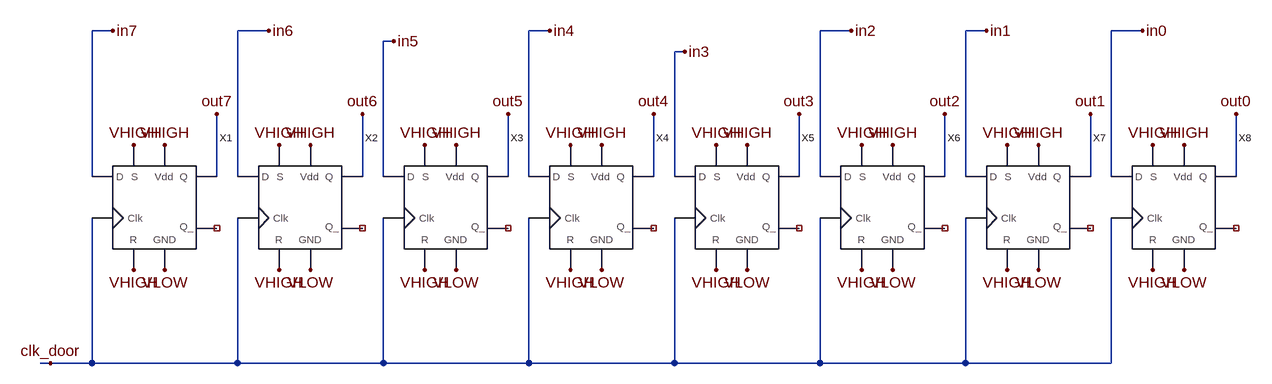
[diagram p0: schematic SAR_OutputDoor.asc]
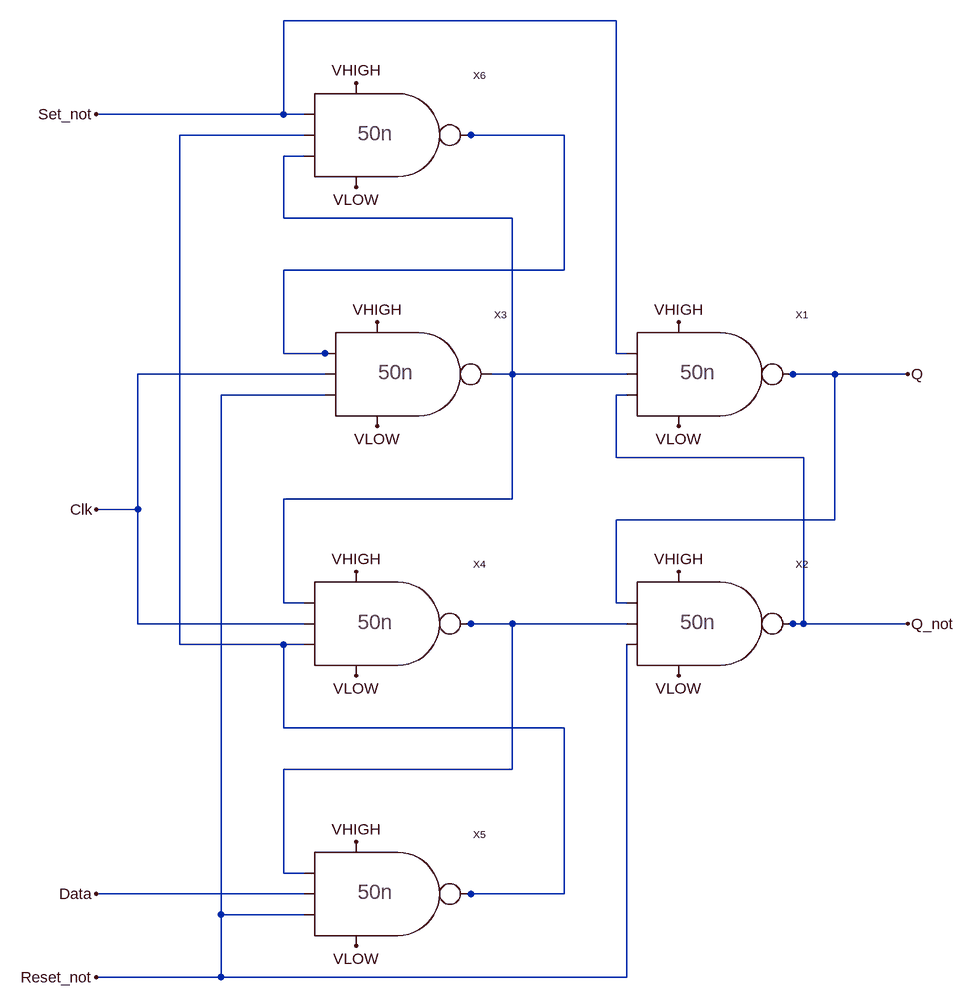
[diagram p1: sub-circuit ti_dff.asc]
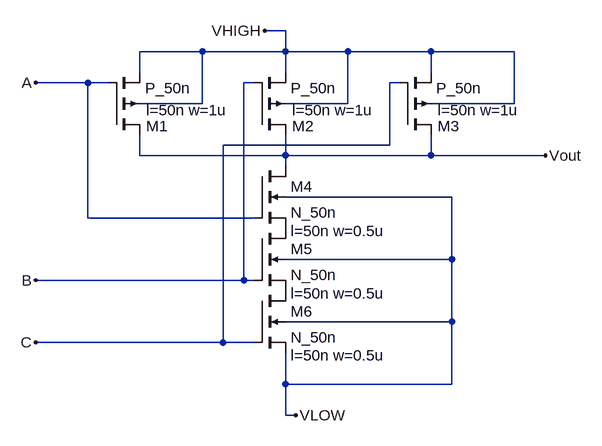
[diagram p2: sub-circuit nand3.asc]
SAR_OutputDoor.asc, the LTspice schematic file:
Version 4
SHEET 1 2904 900
WIRE -32 -96 -64 -96
WIRE 208 -96 160 -96
WIRE 640 -96 608 -96
WIRE 1104 -96 1056 -96
WIRE 1312 -96 1280 -96
WIRE 1552 -96 1504 -96
WIRE 400 -80 384 -80
WIRE 848 -64 832 -64
WIRE -64 128 -64 -96
WIRE 128 128 128 32
WIRE 160 128 160 -96
WIRE 352 128 352 32
WIRE 384 128 384 -80
WIRE 576 128 576 32
WIRE 608 128 608 -96
WIRE 800 128 800 32
WIRE 832 128 832 -64
WIRE 1024 128 1024 32
WIRE 1056 128 1056 -96
WIRE 1248 128 1248 32
WIRE 1280 128 1280 -96
WIRE 1472 128 1472 32
WIRE 1504 128 1504 -96
WIRE 1696 128 1696 32
WIRE -128 416 -144 416
WIRE -64 416 -64 192
WIRE -64 416 -128 416
WIRE 160 416 160 192
WIRE 160 416 -64 416
WIRE 384 416 384 192
WIRE 384 416 160 416
WIRE 608 416 608 192
WIRE 608 416 384 416
WIRE 832 416 832 192
WIRE 832 416 608 416
WIRE 1056 416 1056 192
WIRE 1056 416 832 416
WIRE 1280 416 1280 192
WIRE 1280 416 1056 416
WIRE 1504 416 1504 192
WIRE 1504 416 1280 416
FLAG 48 80 VHIGH
FLAG 0 80 VHIGH
FLAG 0 272 VHIGH
FLAG 48 272 VLOW
FLAG 272 80 VHIGH
FLAG 224 80 VHIGH
FLAG 224 272 VHIGH
FLAG 272 272 VLOW
FLAG 496 80 VHIGH
FLAG 448 80 VHIGH
FLAG 448 272 VHIGH
FLAG 496 272 VLOW
FLAG 720 80 VHIGH
FLAG 672 80 VHIGH
FLAG 672 272 VHIGH
FLAG 720 272 VLOW
FLAG 944 80 VHIGH
FLAG 896 80 VHIGH
FLAG 896 272 VHIGH
FLAG 944 272 VLOW
FLAG 1168 80 VHIGH
FLAG 1120 80 VHIGH
FLAG 1120 272 VHIGH
FLAG 1168 272 VLOW
FLAG 1392 80 VHIGH
FLAG 1344 80 VHIGH
FLAG 1344 272 VHIGH
FLAG 1392 272 VLOW
FLAG 1616 80 VHIGH
FLAG 1568 80 VHIGH
FLAG 1568 272 VHIGH
FLAG 1616 272 VLOW
FLAG -32 -96 in7
FLAG 208 -96 in6
FLAG 400 -80 in5
FLAG 640 -96 in4
FLAG 848 -64 in3
FLAG 1104 -96 in2
FLAG 1312 -96 in1
FLAG 1552 -96 in0
FLAG -128 416 clk_door
FLAG 128 32 out7
FLAG 352 32 out6
FLAG 576 32 out5
FLAG 800 32 out4
FLAG 1024 32 out3
FLAG 1248 32 out2
FLAG 1472 32 out1
FLAG 1696 32 out0
SYMBOL TI_DFF 32 176 R0
SYMATTR InstName X1
SYMBOL TI_DFF 256 176 R0
SYMATTR InstName X2
SYMBOL TI_DFF 480 176 R0
SYMATTR InstName X3
SYMBOL TI_DFF 704 176 R0
SYMATTR InstName X4
SYMBOL TI_DFF 928 176 R0
SYMATTR InstName X5
SYMBOL TI_DFF 1152 176 R0
SYMATTR InstName X6
SYMBOL TI_DFF 1376 176 R0
SYMATTR InstName X7
SYMBOL TI_DFF 1600 176 R0
SYMATTR InstName X8

ti_dff.asc, the sub-circuit schematic file:
Version 4
SHEET 1 1216 1124
WIRE 160 -416 -352 -416
WIRE -352 -272 -352 -416
WIRE -352 -272 -640 -272
WIRE -320 -272 -352 -272
WIRE -320 -240 -512 -240
WIRE -64 -240 -80 -240
WIRE 80 -240 -64 -240
WIRE -320 -208 -352 -208
WIRE -352 -112 -352 -208
WIRE 0 -112 -352 -112
WIRE 80 -32 80 -240
WIRE 80 -32 -352 -32
WIRE -352 96 -352 -32
WIRE -288 96 -352 96
WIRE -272 96 -288 96
WIRE 160 96 160 -416
WIRE 176 96 160 96
WIRE -288 128 -576 128
WIRE 0 128 0 -112
WIRE 0 128 -32 128
WIRE 176 128 0 128
WIRE 432 128 416 128
WIRE 496 128 432 128
WIRE 608 128 496 128
WIRE -288 160 -448 160
WIRE 176 160 160 160
WIRE 160 256 160 160
WIRE 448 256 160 256
WIRE 0 320 0 128
WIRE 0 320 -352 320
WIRE -576 336 -576 128
WIRE -576 336 -640 336
WIRE 496 352 496 128
WIRE 496 352 160 352
WIRE -352 480 -352 320
WIRE -320 480 -352 480
WIRE 160 480 160 352
WIRE 176 480 160 480
WIRE -576 512 -576 336
WIRE -320 512 -576 512
WIRE -64 512 -80 512
WIRE 0 512 -64 512
WIRE 176 512 0 512
WIRE 432 512 416 512
WIRE 448 512 448 256
WIRE 448 512 432 512
WIRE 608 512 448 512
WIRE -512 544 -512 -240
WIRE -352 544 -512 544
WIRE -320 544 -352 544
WIRE -352 672 -352 544
WIRE 80 672 -352 672
WIRE 0 736 0 512
WIRE 0 736 -352 736
WIRE -352 896 -352 736
WIRE -320 896 -352 896
WIRE -320 928 -640 928
WIRE -64 928 -80 928
WIRE 80 928 80 672
WIRE 80 928 -64 928
WIRE -448 960 -448 160
WIRE -320 960 -448 960
WIRE -448 1056 -448 960
WIRE -448 1056 -640 1056
WIRE 176 1056 176 544
WIRE 176 1056 -448 1056
FLAG -640 -272 Set_not
FLAG -640 928 Data
FLAG -640 336 Clk
FLAG -640 1056 Reset_not
FLAG 608 128 Q
FLAG 608 512 Q_not
FLAG -240 848 VHIGH
FLAG -240 432 VHIGH
FLAG 256 432 VHIGH
FLAG -240 -320 VHIGH
FLAG -208 48 VHIGH
FLAG 256 48 VHIGH
FLAG -240 -160 VLOW
FLAG -208 208 VLOW
FLAG 256 208 VLOW
FLAG -240 1008 VLOW
FLAG 256 592 VLOW
FLAG -240 592 VLOW
SYMBOL NAND3 240 128 R0
SYMATTR InstName X1
SYMBOL NAND3 240 512 R0
SYMATTR InstName X2
SYMBOL NAND3 -224 128 R0
SYMATTR InstName X3
SYMBOL NAND3 -256 512 R0
SYMATTR InstName X4
SYMBOL NAND3 -256 928 R0
SYMATTR InstName X5
SYMBOL NAND3 -256 -240 R0
SYMATTR InstName X6

nand3.asc, the sub-circuit schematic file:
Version 4
SHEET 1 880 788
WIRE 320 -96 288 -96
WIRE 192 -64 96 -64
WIRE 320 -64 320 -96
WIRE 320 -64 192 -64
WIRE 416 -64 320 -64
WIRE 544 -64 416 -64
WIRE 672 -64 544 -64
WIRE 96 -32 96 -64
WIRE 320 -32 320 -64
WIRE 544 -32 544 -64
WIRE 16 -16 -64 -16
WIRE 48 -16 16 -16
WIRE 272 -16 256 -16
WIRE 496 -16 480 -16
WIRE 192 16 192 -64
WIRE 192 16 96 16
WIRE 416 16 416 -64
WIRE 416 16 320 16
WIRE 672 16 672 -64
WIRE 672 16 544 16
WIRE 480 80 480 -16
WIRE 480 80 224 80
WIRE 96 96 96 64
WIRE 320 96 320 64
WIRE 320 96 96 96
WIRE 544 96 544 64
WIRE 544 96 320 96
WIRE 720 96 544 96
WIRE 320 112 320 96
WIRE 576 160 320 160
WIRE 16 192 16 -16
WIRE 272 192 16 192
WIRE 576 256 576 160
WIRE 576 256 320 256
WIRE 256 288 256 -16
WIRE 256 288 -64 288
WIRE 272 288 256 288
WIRE 576 352 576 256
WIRE 576 352 320 352
WIRE 224 384 224 80
WIRE 224 384 -64 384
WIRE 272 384 224 384
WIRE 320 448 320 400
WIRE 576 448 576 352
WIRE 576 448 320 448
WIRE 320 496 320 448
WIRE 336 496 320 496
FLAG -64 -16 A
FLAG -64 288 B
FLAG -64 384 C
FLAG 720 96 Vout
FLAG 288 -96 VHIGH
FLAG 336 496 VLOW
SYMBOL pmos4 272 64 M180
WINDOW 0 58 13 Left 2
WINDOW 123 58 38 Left 2
SYMATTR InstName M2
SYMATTR Value2 l=50n w=1u
SYMATTR Value P_50n
SYMBOL pmos4 48 64 M180
WINDOW 0 58 13 Left 2
WINDOW 123 58 38 Left 2
SYMATTR InstName M1
SYMATTR Value2 l=50n w=1u
SYMATTR Value P_50n
SYMBOL pmos4 496 64 M180
WINDOW 0 58 13 Left 2
WINDOW 123 58 38 Left 2
SYMATTR InstName M3
SYMATTR Value2 l=50n w=1u
SYMATTR Value P_50n
SYMBOL nmos4 272 112 R0
WINDOW 123 56 100 Left 2
SYMATTR Value2 l=50n w=0.5u
SYMATTR InstName M4
SYMATTR Value N_50n
SYMBOL nmos4 272 208 R0
WINDOW 123 56 100 Left 2
SYMATTR Value2 l=50n w=0.5u
SYMATTR InstName M5
SYMATTR Value N_50n
SYMBOL nmos4 272 304 R0
WINDOW 123 56 100 Left 2
SYMATTR Value2 l=50n w=0.5u
SYMATTR InstName M6
SYMATTR Value N_50n

The netlist it stands for:
* SAR_OutputDoor.asc
XX1 VHIGH clk_door in7 VHIGH out7 NC_01 VLOW VHIGH ti_dff
XX2 VHIGH clk_door in6 VHIGH out6 NC_02 VLOW VHIGH ti_dff
XX3 VHIGH clk_door in5 VHIGH out5 NC_03 VLOW VHIGH ti_dff
XX4 VHIGH clk_door in4 VHIGH out4 NC_04 VLOW VHIGH ti_dff
XX5 VHIGH clk_door in3 VHIGH out3 NC_05 VLOW VHIGH ti_dff
XX6 VHIGH clk_door in2 VHIGH out2 NC_06 VLOW VHIGH ti_dff
XX7 VHIGH clk_door in1 VHIGH out1 NC_07 VLOW VHIGH ti_dff
XX8 VHIGH clk_door in0 VHIGH out0 NC_08 VLOW VHIGH ti_dff

* block symbol definitions
.subckt ti_dff Set_not Clk Data Reset_not Q Q_not VLOW VHIGH
XX1 Set_not N003 Q_not Q VHIGH VLOW nand3
XX2 Q N004 Reset_not Q_not VHIGH VLOW nand3
XX3 N002 Clk Reset_not N003 VHIGH VLOW nand3
XX4 N003 Clk N001 N004 VHIGH VLOW nand3
XX5 N004 Data Reset_not N001 VHIGH VLOW nand3
XX6 Set_not N001 N003 N002 VHIGH VLOW nand3
.ends ti_dff

.subckt nand3 A B C Vout VHIGH VLOW
M2 Vout B VHIGH VHIGH P_50n l=50n w=1u
M1 Vout A VHIGH VHIGH P_50n l=50n w=1u
M3 Vout C VHIGH VHIGH P_50n l=50n w=1u
M4 Vout A P001 VLOW N_50n l=50n w=0.5u
M5 P001 B P002 VLOW N_50n l=50n w=0.5u
M6 P002 C VLOW VLOW N_50n l=50n w=0.5u
.ends nand3

.model NMOS NMOS
.model PMOS PMOS
.lib standard.mos
.backanno
.end